# Altium schematic sheet Analog_Acquisition_Circuit.SchDoc
size A3; SheetNumber: 1; SheetTotal: 4
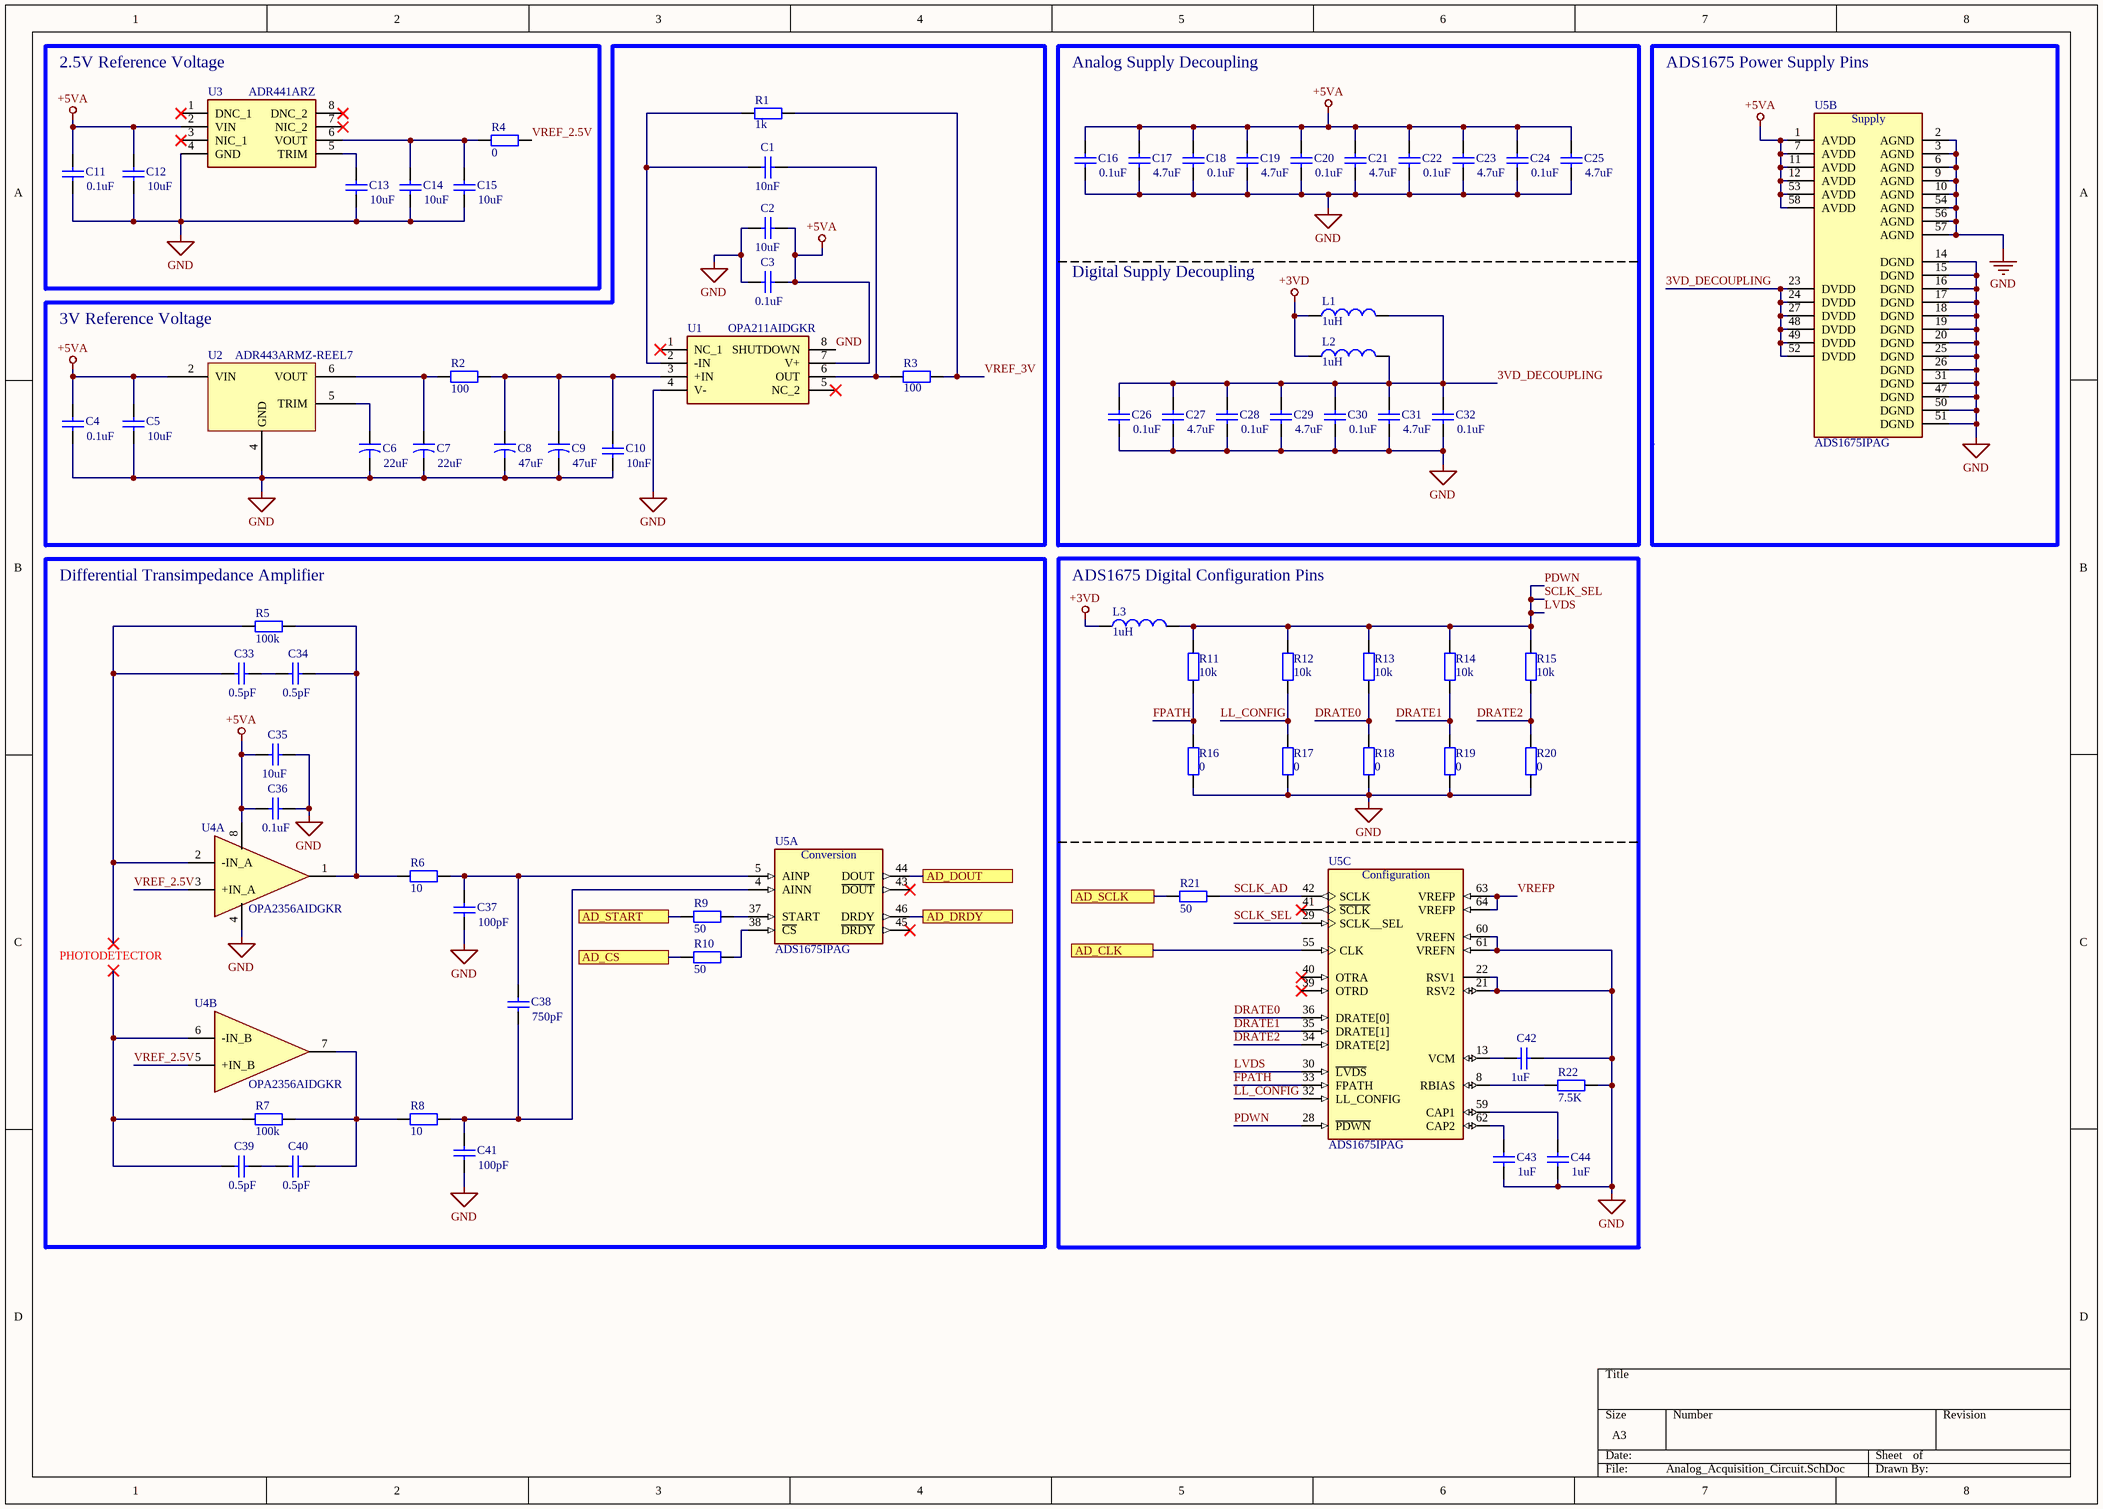
[diagram p0: Analog_Acquisition_Circuit.SchDoc]

## Parts
C1  value 10nF  [RAD-0.3]  (hidden comment: Cap)
C2  value 10uF  [RAD-0.3]  (hidden comment: Cap)
C3  value 0.1uF  [RAD-0.3]  (hidden comment: Cap)
C4  value 0.1uF  [RAD-0.3]  (hidden comment: Cap)
C5  value 10uF  [RAD-0.3]  (hidden comment: Cap)
C6  value 22uF  [CAPR5-4X5]  (hidden comment: Cap2)
C7  value 22uF  [CAPR5-4X5]  (hidden comment: Cap2)
C8  value 47uF  [CAPR5-4X5]  (hidden comment: Cap2)
C9  value 47uF  [CAPR5-4X5]  (hidden comment: Cap2)
C10  value 10nF  [RAD-0.3]  (hidden comment: Cap)
C11  value 0.1uF  [RAD-0.3]  (hidden comment: Cap)
C12  value 10uF  [RAD-0.3]  (hidden comment: Cap)
C13  value 10uF  [RAD-0.3]  (hidden comment: Cap)
C14  value 10uF  [RAD-0.3]  (hidden comment: Cap)
C15  value 10uF  [RAD-0.3]  (hidden comment: Cap)
C16  value 0.1uF  [RAD-0.3]  (hidden comment: Cap)
C17  value 4.7uF  [RAD-0.3]  (hidden comment: Cap)
C18  value 0.1uF  [RAD-0.3]  (hidden comment: Cap)
C19  value 4.7uF  [RAD-0.3]  (hidden comment: Cap)
C20  value 0.1uF  [RAD-0.3]  (hidden comment: Cap)
C21  value 4.7uF  [RAD-0.3]  (hidden comment: Cap)
C22  value 0.1uF  [RAD-0.3]  (hidden comment: Cap)
C23  value 4.7uF  [RAD-0.3]  (hidden comment: Cap)
C24  value 0.1uF  [RAD-0.3]  (hidden comment: Cap)
C25  value 4.7uF  [RAD-0.3]  (hidden comment: Cap)
C26  value 0.1uF  [RAD-0.3]  (hidden comment: Cap)
C27  value 4.7uF  [RAD-0.3]  (hidden comment: Cap)
C28  value 0.1uF  [RAD-0.3]  (hidden comment: Cap)
C29  value 4.7uF  [RAD-0.3]  (hidden comment: Cap)
C30  value 0.1uF  [RAD-0.3]  (hidden comment: Cap)
C31  value 4.7uF  [RAD-0.3]  (hidden comment: Cap)
C32  value 0.1uF  [RAD-0.3]  (hidden comment: Cap)
C33  value 0.5pF  [RAD-0.3]  (hidden comment: Cap)
C34  value 0.5pF  [RAD-0.3]  (hidden comment: Cap)
C35  value 10uF  [RAD-0.3]  (hidden comment: Cap)
C36  value 0.1uF  [RAD-0.3]  (hidden comment: Cap)
C37  value 100pF  [RAD-0.3]  (hidden comment: Cap)
C38  value 750pF  [RAD-0.3]  (hidden comment: Cap)
C39  value 0.5pF  [RAD-0.3]  (hidden comment: Cap)
C40  value 0.5pF  [RAD-0.3]  (hidden comment: Cap)
C41  value 100pF  [RAD-0.3]  (hidden comment: Cap)
C42  value 1uF  [RAD-0.3]  (hidden comment: Cap)
C43  value 1uF  [RAD-0.3]  (hidden comment: Cap)
C44  value 1uF  [RAD-0.3]  (hidden comment: Cap)
L1  value 1uH  [0402-A]  (hidden comment: Inductor)
L2  value 1uH  [0402-A]  (hidden comment: Inductor)
L3  value 1uH  [0402-A]  (hidden comment: Inductor)
R1  value 1k  [AXIAL-0.4]  (hidden comment: Res2)
R2  value 100  [AXIAL-0.4]  (hidden comment: Res2)
R3  value 100  [AXIAL-0.4]  (hidden comment: Res2)
R4  value 0  [AXIAL-0.4]  (hidden comment: Res2)
R5  value 100k  [AXIAL-0.4]  (hidden comment: Res2)
R6  value 10  [AXIAL-0.4]  (hidden comment: Res2)
R7  value 100k  [AXIAL-0.4]  (hidden comment: Res2)
R8  value 10  [AXIAL-0.4]  (hidden comment: Res2)
R9  value 50  [AXIAL-0.4]  (hidden comment: Res2)
R10  value 50  [AXIAL-0.4]  (hidden comment: Res2)
R11  value 10k  [AXIAL-0.4]  (hidden comment: Res2)
R12  value 10k  [AXIAL-0.4]  (hidden comment: Res2)
R13  value 10k  [AXIAL-0.4]  (hidden comment: Res2)
R14  value 10k  [AXIAL-0.4]  (hidden comment: Res2)
R15  value 10k  [AXIAL-0.4]  (hidden comment: Res2)
R16  value 0  [AXIAL-0.4]  (hidden comment: Res2)
R17  value 0  [AXIAL-0.4]  (hidden comment: Res2)
R18  value 0  [AXIAL-0.4]  (hidden comment: Res2)
R19  value 0  [AXIAL-0.4]  (hidden comment: Res2)
R20  value 0  [AXIAL-0.4]  (hidden comment: Res2)
R21  value 50  [AXIAL-0.4]  (hidden comment: Res2)
R22  value 7.5K  [AXIAL-0.4]  (hidden comment: Res2)
U1  OPA211AIDGKR  [SOP65P490X110-8N]
U2  ADR443ARMZ-REEL7  [ADR443ARMZ-REEL7 - duplicate]
U3  ADR441ARZ  [ADR441ARZ]
U4  OPA2356AIDGKR  [OPA2356AIDGKR]  (parts A,B of 2)
U5  ADS1675IPAG  [ADS1675IPAG]  (parts A,B,C of 3)

## Blocks framed on the sheet
2.5V Reference Voltage: C11-C15 R4 U3
3V Reference Voltage: C1-C10 R1-R3 U1 U2
ADS1675 Power Supply Pins: U5
Differential Transimpedance Amplifier: C33-C41 R5-R10 U4 U5
ADS1675 Digital Configuration Pins: C42-C44 L3 R11-R22 U5

## Ports
AD_CLK (see Digital_STMG447RET6[5B], Digital_Supply_and_Connectors[2A], Digital_Supply_and_Connectors[4A], Digital_Supply_and_Connectors[7B]), AD_CS (see Digital_STMG447RET6[2B], Digital_Supply_and_Connectors[1A], Digital_Supply_and_Connectors[4A]), AD_DOUT (see Digital_STMG447RET6[5B], Digital_Supply_and_Connectors[1A]), AD_DRDY (see Digital_STMG447RET6[2B], Digital_Supply_and_Connectors[1A]), AD_SCLK (see Digital_STMG447RET6[5B], Digital_Supply_and_Connectors[1A], Digital_Supply_and_Connectors[4A]), AD_START (see Digital_STMG447RET6[3B], Digital_Supply_and_Connectors[1A], Digital_Supply_and_Connectors[4A])

## Nets
+3VD: L1.1 L2.1 L3.1
+5VA: C2.1 C3.1 C4.2 C5.2 C11.2 C12.2 C16.2 C17.2 C18.2 C19.2 C20.2 C21.2 C22.2 C23.2 C24.2 C25.2 C35.2 C36.2 U1.7(V+) U2.2(VIN) U3.2(VIN) U4.8(V+) U5.1(AVDD) U5.7(AVDD) U5.11(AVDD) U5.12(AVDD) U5.53(AVDD) U5.58(AVDD)
GND: C2.2 C3.2 C4.1 C5.1 C6.2 C7.2 C8.2 C9.2 C10.1 C11.1 C12.1 C13.1 C14.1 C15.1 C16.1 C17.1 C18.1 C19.1 C20.1 C21.1 C22.1 C23.1 C24.1 C25.1 C26.1 C27.1 C28.1 C29.1 C30.1 C31.1 C32.1 C35.1 C36.1 C37.1 C41.1 C42.1 C43.2 C44.2 R16.1 R17.1 R18.1 R19.1 R20.1 R22.2 U1.4(V-) U1.8(SHUTDOWN) U2.4(GND) U3.4(GND) U4.4(V-) U5.2(AGND) U5.3(AGND) U5.6(AGND) U5.9(AGND) U5.10(AGND) U5.14(DGND) U5.15(DGND) U5.16(DGND) U5.17(DGND) U5.18(DGND) U5.19(DGND) U5.20(DGND) U5.21(RSV2) U5.22(RSV1) U5.25(DGND) U5.26(DGND) U5.31(DGND) U5.47(DGND) U5.50(DGND) U5.51(DGND) U5.54(AGND) U5.56(AGND) U5.57(AGND) U5.60(VREFN) U5.61(VREFN)
3VD_DECOUPLING: C26.2 C27.2 C28.2 C29.2 C30.2 C31.2 C32.2 L1.2 L2.2 U5.23(DVDD) U5.24(DVDD) U5.27(DVDD) U5.48(DVDD) U5.49(DVDD) U5.52(DVDD)
AD_CLK: U5.55(CLK) ; port AD_CLK
AD_CS: R10.1 ; port AD_CS
AD_DOUT: U5.44(DOUT) ; port AD_DOUT
AD_DRDY: U5.46(DRDY) ; port AD_DRDY
AD_SCLK: R21.1 ; port AD_SCLK
AD_START: R9.1 ; port AD_START
DRATE0: R13.1 R18.2 U5.36(DRATE[0])
DRATE1: R14.1 R19.2 U5.35(DRATE[1])
DRATE2: R15.1 R20.2 U5.34(DRATE[2])
FPATH: R11.1 R16.2 U5.33(FPATH)
LL_CONFIG: R12.1 R17.2 U5.32(LL_CONFIG)
LVDS: L3.2 R11.2 R12.2 R13.2 R14.2 R15.2 U5.28(~{PDWN}) U5.29(SCLK__SEL) U5.30(~{LVDS})  [also labelled PDWN, SCLK_SEL]
SCLK_AD: R21.2 U5.42(SCLK)
VREF_2.5V: R4.2 U4.3(+IN_A) U4.5(+IN_B)
VREF_3V: R1.1 R3.1
VREFP: U5.63(VREFP) U5.64(VREFP)
NetC1_1: C1.1 R3.2 U1.6(OUT)
NetC1_2: C1.2 R1.2 U1.2(-IN)
NetC6_1: C6.1 U2.5(TRIM)
NetC7_1: C7.1 R2.1 U2.6(VOUT)
NetC8_1: C8.1 C9.1 C10.2 R2.2 U1.3(+IN)
NetC13_2: C13.2 U3.5(TRIM)
NetC14_2: C14.2 C15.2 R4.1 U3.6(VOUT)
NetC33_1: C33.1 C34.2
NetC33_2: C33.2 R5.1 U4.2(-IN_A)
NetC34_1: C34.1 R5.2 R6.1 U4.1(OUT_A)
NetC37_2: C37.2 C38.2 R6.2 U5.5(AINP)
NetC38_1: C38.1 C41.2 R8.2 U5.4(AINN)
NetC39_1: C39.1 C40.2
NetC39_2: C39.2 R7.1 U4.6(-IN_B)
NetC40_1: C40.1 R7.2 R8.1 U4.7(OUT_B)
NetC42_2: C42.2 U5.13(VCM)
NetC43_1: C43.1 U5.62(CAP2)
NetC44_1: C44.1 U5.59(CAP1)
NetR9_2: R9.2 U5.37(START)
NetR10_2: R10.2 U5.38(~{CS})
NetR22_1: R22.1 U5.8(RBIAS)

Not connected (* = marked no-connect by the designer): U1 1(NC_1)* 5(NC_2)*; U3 1(DNC_1)* 3(NIC_1)* 7(NIC_2)* 8(DNC_2)*; U5 39(OTRD)* 40(OTRA)* 41(~{S}~{C}~{L}~{K})* 43(~{DOUT})* 45(~{DRDY})*

## Notes on the sheet
- Analog Supply Decoupling
- (near L1) Digital Supply Decoupling
- PHOTODETECTOR
- (in symbol ADS1675IPAG, part A) Conversion
- (in symbol ADS1675IPAG, part B) Supply
- (in symbol ADS1675IPAG, part C) Configuration

## Library data of the parts
C1-C5 C10-C44 = Cap: Capacitor; Published: 8-Jun-2000; LatestRevisionDate: 17-Jul-2002; LatestRevisionNote: Re-released for DXP Platform.; PackageReference: RAD-0.3; Publisher: Altium Limited; PackageDescription: Radial Cap, Thru-Hole; 2 Leads; 0.3 in Pin Spacing
C6-C9 = Cap2: Capacitor; Published: 23-Sep-2002; PackageReference: CAPR5-4X5; Publisher: Altium Limited; PackageDescription: Capacitor; 2 Leads
L1-L3 = Inductor: Code_IEC: 1005; Published: 8-Jun-2000; LatestRevisionDate: 29-May-2009; LatestRevisionNote: IPC-7351 Footprint Added.; PackageReference: 0402-A; Publisher: Altium Limited; PackageDescription: Chip Inductor; Code_JEITA: 0402
R1-R22 = Res2: Resistor; Published: 8-Jun-2000; LatestRevisionDate: 17-Jul-2002; LatestRevisionNote: Re-released for DXP Platform.; PackageReference: AXIAL-0.4; Publisher: Altium Limited; PackageDescription: Axial Device, Thru-Hole; 2 Leads; 0.4 in Pin Spacing
U1 = OPA211AIDGKR: Precision Amplifiers 1.1nV/rtHz Noise Lo Pwr Prec Op Amp; Manufacturer_Name: Texas Instruments; Geometry.Height: 1.1mm; Manufacturer_Part_Number: OPA211AIDGKR; Mouser Part Number: 595-OPA211AIDGKR; Mouser Price/Stock: https://www.mouser.co.uk/ProductDetail/Texas-Instruments/OPA211AIDGKR?qs=iSMark9AYDXgBzgxm95hVg%3D%3D; Arrow Part Number: OPA211AIDGKR; Arrow Price/Stock: https://www.arrow.com/en/products/opa211aidgkr/texas-instruments?utm_currency=USD&region=nac; Datasheet Link: https://www.ti.com/general/docs/suppproductinfo.tsp?distId=10&gotoUrl=https%3A%2F%2Fwww.ti.com%2Flit%2Fgpn%2Fopa211
U2 = ADR443ARMZ-REEL7: Ultralow Noise, LDO XFET Voltage Reference with Current Sink and Source, 3 V Output, 3.5 to 18 V Supply, Industrial, 8-pin SOP (RM-8), Reel
U3 = ADR441ARZ: Series Voltage Reference IC Fixed 2.5V V +/-0.12% 10 mA 8-SOIC; Manufacturer_Name: Analog Devices; Geometry.Height: 1.75mm; Manufacturer_Part_Number: ADR441ARZ; Mouser Part Number: 584-ADR441ARZ; Mouser Price/Stock: https://www.mouser.co.uk/ProductDetail/Analog-Devices/ADR441ARZ?qs=WIvQP4zGanjF%252B9HT%2FrItQQ%3D%3D; Arrow Part Number: ADR441ARZ; Arrow Price/Stock: https://www.arrow.com/en/products/adr441arz/analog-devices?region=europe; Datasheet Link: https://www.analog.com/media/en/technical-documentation/data-sheets/adr440_441_443_444_445.pdf
U4 = OPA2356AIDGKR: High Speed Operational Amplifiers 2.5V 200MHz GBW CMOS Dual Op Amp; Manufacturer_Name: Texas Instruments; Geometry.Height: 1.1mm; Manufacturer_Part_Number: OPA2356AIDGKR; Mouser Part Number: 595-OPA2356AIDGKR; Mouser Price/Stock: https://www.mouser.co.uk/ProductDetail/Texas-Instruments/OPA2356AIDGKR?qs=7nS3%252BbEUL6thmoW05USD8Q%3D%3D; Arrow Part Number: OPA2356AIDGKR; Arrow Price/Stock: https://www.arrow.com/en/products/opa2356aidgkr/texas-instruments?region=nac; Datasheet Link: http://www.ti.com/lit/ds/symlink/opa2356.pdf
U5 = ADS1675IPAG: 4MSPS, 24-Bit Analog-to-Digital Converter; MF: Texas Instruments; SnapEDA_Link: https://www.snapeda.com/parts/ADS1675IPAG/Texas+Instruments/view-part/?ref=snap; Package: TQFP-64 Texas Instruments; MP: ADS1675IPAG; Check_prices: https://www.snapeda.com/parts/ADS1675IPAG/Texas+Instruments/view-part/?ref=eda; Purchase-URL: https://pricing.snapeda.com/search/part/ADS1675IPAG/?ref=eda; Price: None; Value: *; Availability: In Stock